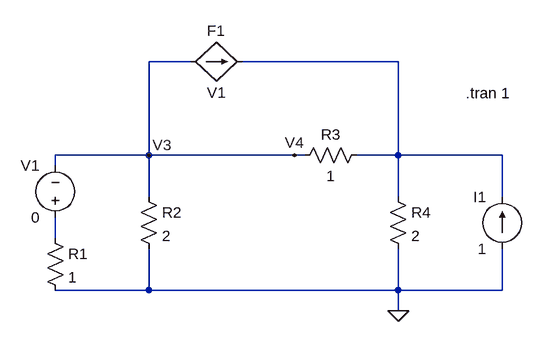
[diagram p0: schematic g3_p14_ok_trans.asc]
g3_p14_ok_trans.asc, the LTspice schematic file:
Version 4
SHEET 1 880 680
WIRE 176 -48 112 -48
WIRE 496 -48 256 -48
WIRE 112 96 112 -48
WIRE 112 96 -32 96
WIRE 336 96 112 96
WIRE 352 96 336 96
WIRE 496 96 496 -48
WIRE 496 96 432 96
WIRE 656 96 496 96
WIRE -32 112 -32 96
WIRE 112 160 112 96
WIRE 496 160 496 96
WIRE 656 160 656 96
WIRE -32 224 -32 192
WIRE 112 304 112 240
WIRE 112 304 -32 304
WIRE 496 304 496 240
WIRE 496 304 112 304
WIRE 656 304 656 240
WIRE 656 304 496 304
WIRE 496 336 496 304
FLAG 496 336 0
FLAG 112 96 V3
FLAG 336 96 V4
SYMBOL res -48 208 R0
SYMATTR InstName R1
SYMATTR Value 1
SYMBOL res 96 144 R0
SYMATTR InstName R2
SYMATTR Value 2
SYMBOL res 448 80 R90
WINDOW 0 0 56 VBottom 2
WINDOW 3 32 56 VTop 2
SYMATTR InstName R3
SYMATTR Value 1
SYMBOL res 480 144 R0
SYMATTR InstName R4
SYMATTR Value 2
SYMBOL voltage -32 208 R180
WINDOW 0 24 96 Left 2
WINDOW 3 24 16 Left 2
SYMATTR InstName V1
SYMATTR Value 0
SYMBOL current 656 240 R180
WINDOW 0 24 80 Left 2
WINDOW 3 24 0 Left 2
SYMATTR InstName I1
SYMATTR Value 1
SYMBOL f 176 -48 R270
WINDOW 0 32 40 VTop 2
WINDOW 3 -32 40 VBottom 2
SYMATTR InstName F1
SYMATTR Value V1
SYMATTR Value2 2
TEXT 600 0 Left 2 !.tran 1

The netlist it stands for:
* g3_p14_ok_trans.asc
R1 N002 0 1
R2 V4 0 2
R3 N001 V4 1
R4 N001 0 2
V1 N002 V4 0
I1 0 N001 1
F1 V4 N001 V1 2
.tran 1
.backanno
.end